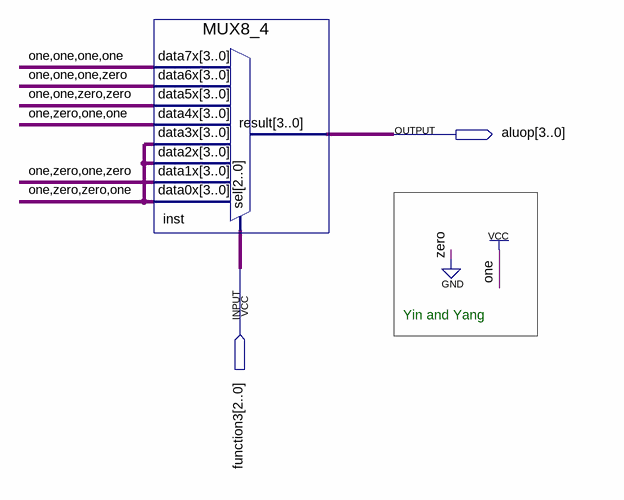
[diagram p0: schematic sheet]
// Quartus schematic ALUBranchOperationCode.bdf as structural Verilog: 1 symbols, 2 pins
module ALUBranchOperationCode (
  input  [2:0] function3,
  output [3:0] aluop
);

  MUX8_4 inst (
    .data7x(4'b1111), .data6x(4'b1110), .data5x(4'b1100), .data4x(4'b1011), .data3x(4'b1001),
    .data2x(4'b1001), .data1x(4'b1010), .data0x(4'b1001), .sel(function3), .result(aluop));

  // Notes on the sheet:
  //   Yin and Yang
endmodule
